# EAGLE design Driver (EAGLE 9.6.2)
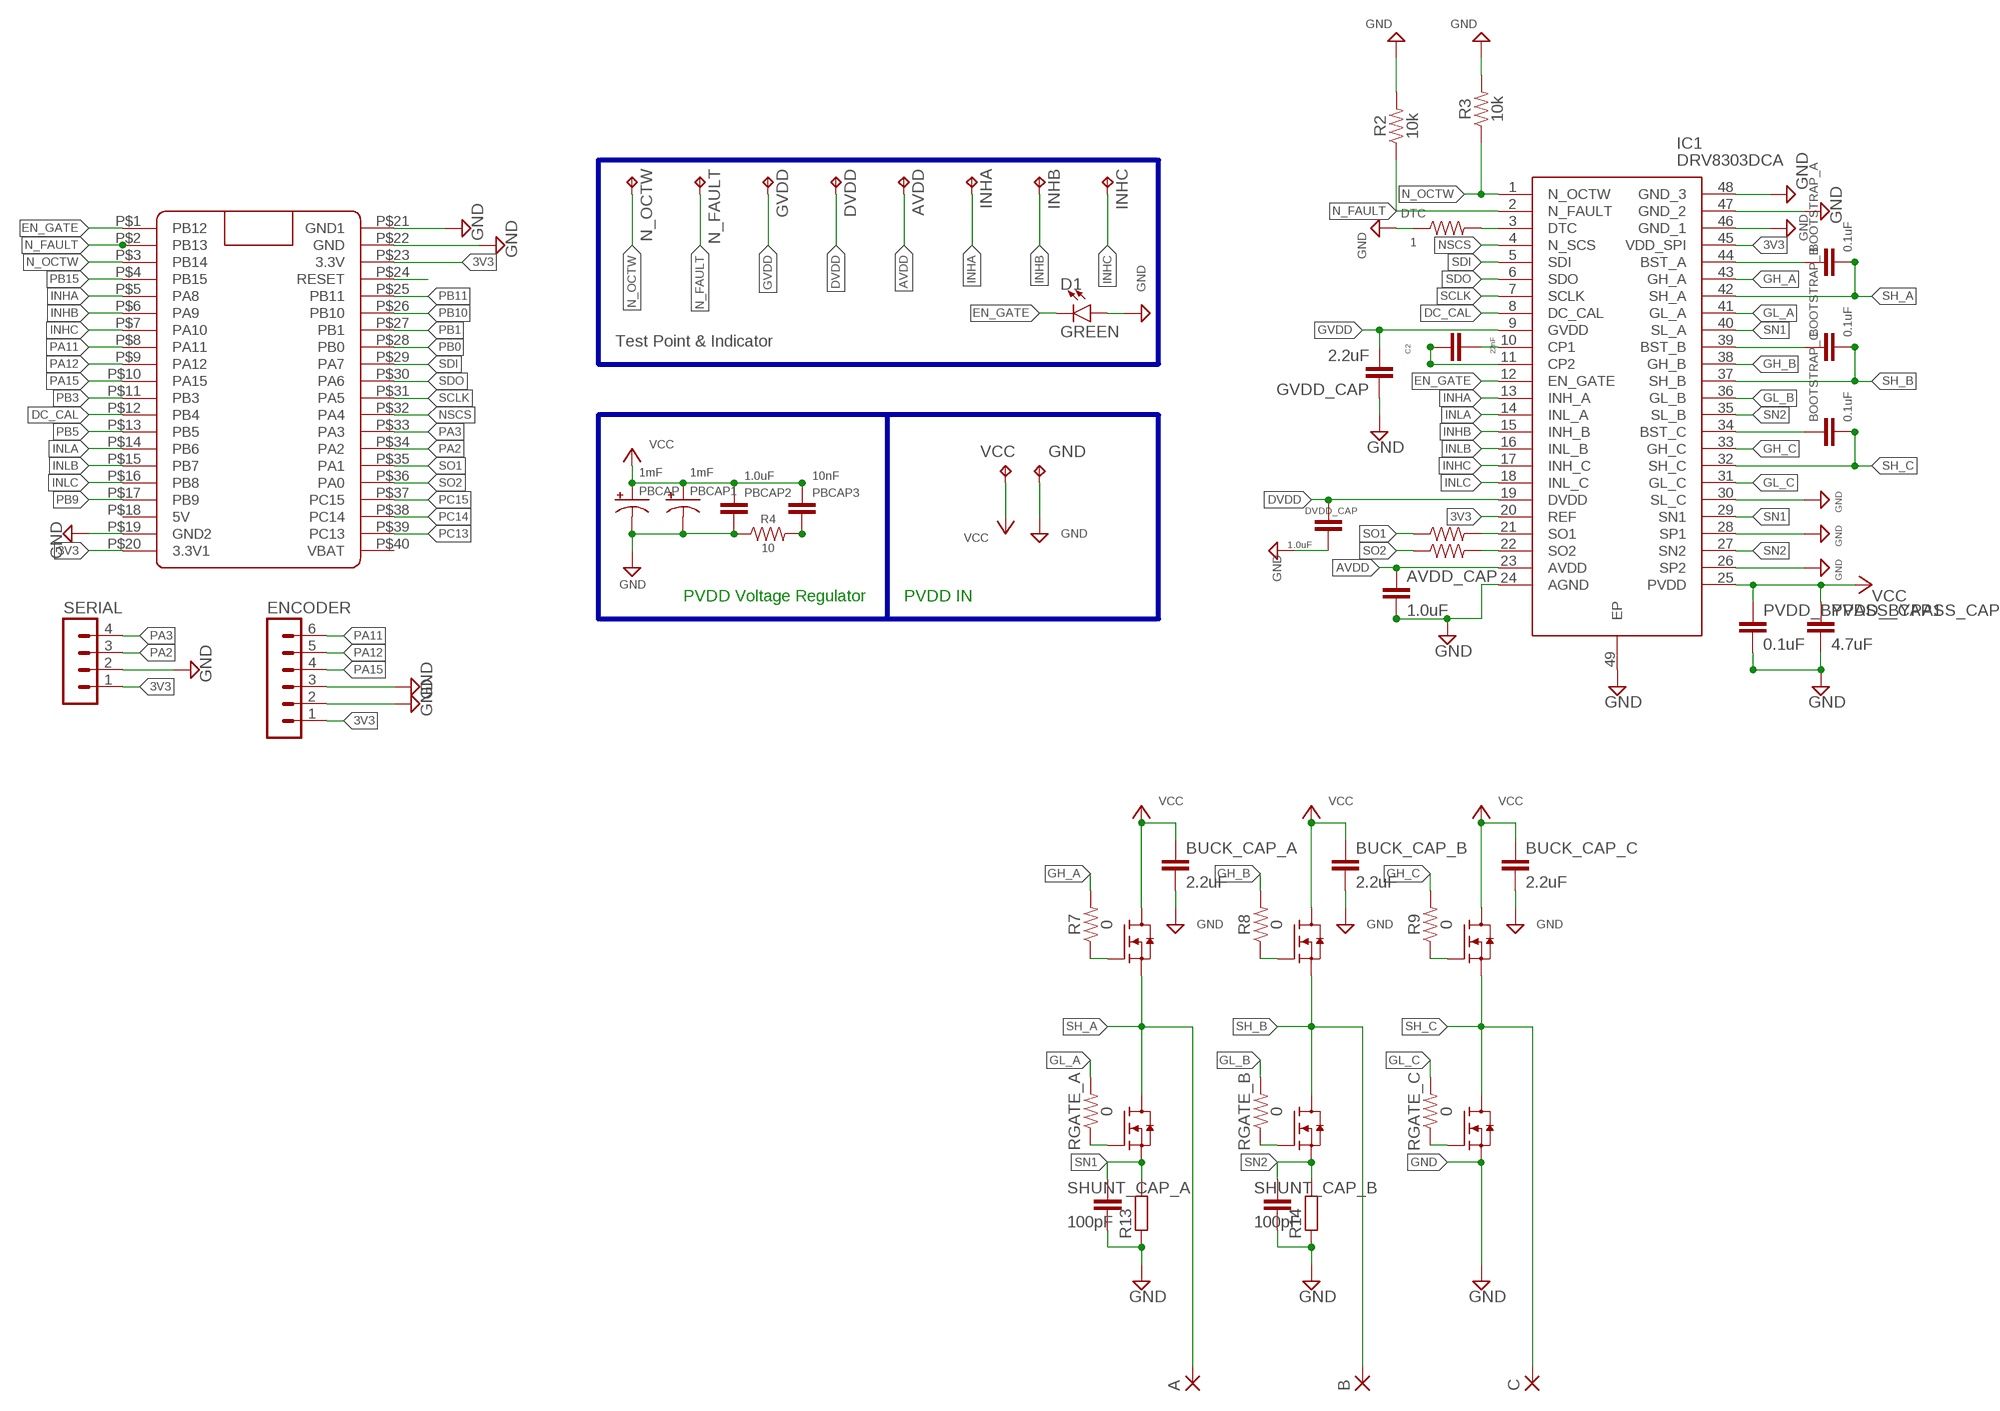
[diagram p0: schematic, sheet 1]

## Parts
A  SMD5  [SMD2,54-5,08]
AVDD  TPTP16R  [TP16R]
AVDD_CAP  1.0uF  1.0UF-0603-16V-10%  [0603]
B  SMD5  [SMD2,54-5,08]
BOOTSTRAP_A  0.1uF  0.1UF-0603-25V-(+80/-20%)  [0603]
BOOTSTRAP_B  0.1uF  0.1UF-0603-25V-(+80/-20%)  [0603]
BOOTSTRAP_C  0.1uF  0.1UF-0603-25V-(+80/-20%)  [0603]
BUCK_CAP_A  2.2uF  2.2UF-0603-10V-20%  [0603]
BUCK_CAP_B  2.2uF  2.2UF-0603-10V-20%  [0603]
BUCK_CAP_C  2.2uF  2.2UF-0603-10V-20%  [0603]
C  SMD5  [SMD2,54-5,08]
C2  22nF  22NF/22,000PF-0603-50V-10%  [0603]
D1  GREEN  LED-GREEN0603  [LED-0603]
DTC  1  1OHM-0603-1/10W-1%  [0603]
DVDD  TPTP16R  [TP16R]
DVDD_CAP  1.0uF  1.0UF-0603-16V-10%  [0603]
ENCODER  MA06-1  [MA06-1]
GND  TPPAD1-20Y  [P1-20Y]
GVDD  TPTP16R  [TP16R]
GVDD_CAP  2.2uF  2.2UF-0603-10V-20%  [0603]
HA  IRLR7843  [TO252]
HB  IRLR7843  [TO252]
HC  IRLR7843  [TO252]
IC1  DRV8303DCA  [SOP50P810X120-49N]
INHA  TPTP16R  [TP16R]
INHB  TPTP16R  [TP16R]
INHC  TPTP16R  [TP16R]
LA  IRLR7843  [TO252]
LB  IRLR7843  [TO252]
LC  IRLR7843  [TO252]
N_FAULT  TPTP16R  [TP16R]
N_OCTW  TPTP16R  [TP16R]
PBCAP  1mF  1000UF-RADIAL-5MM-25V-20%  [CPOL-RADIAL-5MM-10MM]
PBCAP1  1mF  1000UF-RADIAL-5MM-25V-20%  [CPOL-RADIAL-5MM-10MM]
PBCAP2  1.0uF  1.0UF-0603-16V-10%  [0603]
PBCAP3  10nF  10NF-0603-50V-10%  [0603]
PVDD_BYPASS_CAP1  0.1uF  0.1UF-0603-25V-(+80/-20%)  [0603]
PVDD_BYPASS_CAP2  4.7uF  4.7UF-0603-35V-(20%)  [0603]
R2  10k  10KOHM-0603-1/10W-1%  [0603]
R3  10k  10KOHM-0603-1/10W-1%  [0603]
R4  10  10OHM-0603-1/10W-1%  [0603]
R5  47  47OHM-0603-1/10W-1%  [0603]
R6  47  47OHM-0603-1/10W-1%  [0603]
R7  0  0OHM-0603-1/10W  [0603]
R8  0  0OHM-0603-1/10W  [0603]
R9  0  0OHM-0603-1/10W  [0603]
R13  R-EU_R2512  [R2512]
R14  R-EU_R2512  [R2512]
RGATE_A  0  0OHM-0603-1/10W  [0603]
RGATE_B  0  0OHM-0603-1/10W  [0603]
RGATE_C  0  0OHM-0603-1/10W  [0603]
SERIAL  MA04-1  [MA04-1]
SHUNT_CAP_A  100pF  100PF-0603-50V-5%  [0603]
SHUNT_CAP_B  100pF  100PF-0603-50V-5%  [0603]
U$1  BLUE_PILLADVANCED  [BLUE_PILL_ADV]
VCC  TPPAD1-20Y  [P1-20Y]

## Nets
3V3: ENCODER.1 IC1.20(REF) IC1.45(VDD_SPI) SERIAL.1 U$1.P$20(3.3V1) U$1.P$23(3.3V)
AVDD: AVDD.TP AVDD_CAP.1 IC1.23(AVDD)
DC_CAL: IC1.8(DC_CAL) U$1.P$12(PB4)
DVDD: DVDD.TP DVDD_CAP.1 IC1.19(DVDD)
EN_GATE: D1.C IC1.12(EN_GATE) U$1.P$1(PB12)
GH_A: IC1.43(GH_A) R7.2
GH_B: IC1.38(GH_B) R8.2
GH_C: IC1.33(GH_C) R9.2
GL_A: IC1.41(GL_A) RGATE_A.2
GL_B: IC1.36(GL_B) RGATE_B.2
GL_C: IC1.31(GL_C) RGATE_C.2
GND: AVDD_CAP.2 BUCK_CAP_A.2 BUCK_CAP_B.2 BUCK_CAP_C.2 D1.A DTC.1 DVDD_CAP.2 ENCODER.2 ENCODER.3 GND.TP GVDD_CAP.1 IC1.24(AGND) IC1.26(SP2) IC1.28(SP1) IC1.30(SL_C) IC1.46(GND_1) IC1.47(GND_2) IC1.48(GND_3) IC1.49(EP) LC.2(S) PBCAP1.- PBCAP2.2 PBCAP.- PVDD_BYPASS_CAP1.2 PVDD_BYPASS_CAP2.2 R2.2 R3.2 R4.1 R13.1 R14.1 SERIAL.2 SHUNT_CAP_A.2 SHUNT_CAP_B.2 U$1.P$19(GND2) U$1.P$21(GND1) U$1.P$22(GND)
GVDD: GVDD.TP GVDD_CAP.2 IC1.9(GVDD)
INHA: IC1.13(INH_A) INHA.TP U$1.P$5(PA8)
INHB: IC1.15(INH_B) INHB.TP U$1.P$6(PA9)
INHC: IC1.17(INH_C) INHC.TP U$1.P$7(PA10)
INLA: IC1.14(INL_A) U$1.P$14(PB6)
INLB: IC1.16(INL_B) U$1.P$15(PB7)
INLC: IC1.18(INL_C) U$1.P$16(PB8)
N$1: DTC.2 IC1.3(DTC)
N$3: PBCAP3.2 R4.2
N$4: U$1.P$24(RESET)
N$6: BOOTSTRAP_A.1 IC1.44(BST_A)
N$8: HA.1(G) R7.1
N$9: HB.1(G) R8.1
N$10: HC.1(G) R9.1
N$11: BOOTSTRAP_B.1 IC1.39(BST_B)
N$15: LC.1(G) RGATE_C.1
N$16: BOOTSTRAP_C.1 IC1.34(BST_C)
N$17: LB.1(G) RGATE_B.1
N$18: LA.1(G) RGATE_A.1
N$35: C2.2 IC1.10(CP1)
N$36: C2.1 IC1.11(CP2)
N_FAULT: IC1.2(N_FAULT) N_FAULT.TP R2.1 U$1.P$2(PB13)
N_OCTW: IC1.1(N_OCTW) N_OCTW.TP R3.1 U$1.P$3(PB14)
NSCS: IC1.4(N_SCS) U$1.P$32(PA4)
PA2: SERIAL.3 U$1.P$34(PA2)
PA3: SERIAL.4 U$1.P$33(PA3)
PA11: ENCODER.6 U$1.P$8(PA11)
PA12: ENCODER.5 U$1.P$9(PA12)
PA15: ENCODER.4 U$1.P$10(PA15)
PB0: U$1.P$28(PB0)
PB1: U$1.P$27(PB1)
PB3: U$1.P$11(PB3)
PB5: U$1.P$13(PB5)
PB9: U$1.P$17(PB9)
PB10: U$1.P$26(PB10)
PB11: U$1.P$25(PB11)
PB15: U$1.P$4(PB15)
PC13: U$1.P$39(PC13)
PC14: U$1.P$38(PC14)
PC15: U$1.P$37(PC15)
SCLK: IC1.7(SCLK) U$1.P$31(PA5)
SDI: IC1.5(SDI) U$1.P$29(PA7)
SDO: IC1.6(SDO) U$1.P$30(PA6)
SH_A: A.1(P) BOOTSTRAP_A.2 HA.2(S) IC1.42(SH_A) LA.3(D)
SH_B: B.1(P) BOOTSTRAP_B.2 HB.2(S) IC1.37(SH_B) LB.3(D)
SH_C: BOOTSTRAP_C.2 C.1(P) HC.2(S) IC1.32(SH_C) LC.3(D)
SN1: IC1.29(SN1) IC1.40(SL_A) LA.2(S) R13.2 SHUNT_CAP_A.1
SN2: IC1.27(SN2) IC1.35(SL_B) LB.2(S) R14.2 SHUNT_CAP_B.1
SO1: R5.1 U$1.P$35(PA1)
SO1B: IC1.21(SO1) R5.2
SO2: R6.1 U$1.P$36(PA0)
SO2B: IC1.22(SO2) R6.2
VCC: BUCK_CAP_A.1 BUCK_CAP_B.1 BUCK_CAP_C.1 HA.3(D) HB.3(D) HC.3(D) IC1.25(PVDD) PBCAP1.+ PBCAP2.1 PBCAP3.1 PBCAP.+ PVDD_BYPASS_CAP1.1 PVDD_BYPASS_CAP2.1 VCC.TP
Unconnected: U$1.P$18(5V) U$1.P$40(VBAT)

## Buses
B$1
B$2

## Notes on the sheet
- Test Point & Indicator
- PVDD Voltage Regulator | PVDD IN

## Library data of the parts
A B C = wirepad:SMD5: SMD PAD
AVDD DVDD GND GVDD INHA INHB INHC N_FAULT N_OCTW VCC = testpad:TP: Test pad
AVDD_CAP DVDD_CAP PBCAP2 = SparkFun-Capacitors:1.0UF: 1µF ceramic capacitors A capacitor is a passive two-terminal electrical component used to store electrical energy temporarily in an electric field.; PROD_ID: CAP-00868
BOOTSTRAP_A BOOTSTRAP_B BOOTSTRAP_C PVDD_BYPASS_CAP1 = SparkFun-Capacitors:0.1UF: 0.1µF ceramic capacitors A capacitor is a passive two-terminal electrical component used to store electrical energy temporarily in an electric field.; PROD_ID: CAP-00810
BUCK_CAP_A BUCK_CAP_B BUCK_CAP_C GVDD_CAP = SparkFun-Capacitors:2.2UF: 2.2µF ceramic capacitors A capacitor is a passive two-terminal electrical component used to store electrical energy temporarily in an electric field.; PROD_ID: CAP-07888
C2 = SparkFun-Capacitors:22NF/22,000PF: 0.022uF/22nF/22,000pF ceramic capacitors A capacitor is a passive two-terminal electrical component used to store electrical energy temporarily in an electric field.; PROD_ID: CAP-07885
D1 = SparkFun-LED:LED-GREEN: Green SMD LED Used in manufacturing of various products at SparkFun Packages: 0603 - SMD 0603 package [Product Link] <http://www.futureelectronics.com/en/technologies/semiconductors/optoelectronics/leds/Pages/9894312-LTST-C190GKT.aspx?CrossPart=HSMG-C190&IM=0> LilyPad 1206 - SMD1206 LilyPad package [Product Link] <http://www.futureelectronics.com/en/Technologies/Product.aspx?ProductID=IN150NGHARVATEKCORPORATION2049943&IM=0> 1206 - SMD1206 package [Product Link] <http://www.futureelectronics.com/en/technologies/semiconductors/optoelectronics/leds/Pages/8315665-LTST-C150KGKT.aspx?IM=0> 1206 Bottom Mount -SMD 1206 Bottom Mount [Product Link] <http://www.digikey.com/product-detail/en/lite-on-inc/LTST-C230KGKT/160-1456-1-ND/386854> SparkFun Products: Pro Mini 328 -5V <https://www.sparkfun.com/products/821> RedBoard <https://www.sparkfun.com/products/12757> MP3 Trigger <https://www.sparkfun.com/products/13720> Makey Makey <https://www.sparkfun.com/products/11076>; PROD_ID: DIO-00821
DTC = SparkFun-Resistors:1OHM: 1Ω resistor A resistor is a passive two-terminal electrical component that implements electrical resistance as a circuit element. Resistors act to reduce current flow, and, at the same time, act to lower voltage levels within circuits. - Wikipedia; PROD_ID: RES-08269
ENCODER = con-lstb:MA06-1: PIN HEADER; OC_FARNELL: unknown; OC_NEWARK: unknown
HA HB HC LA LB LC = BLDC project:IRLR7843
IC1 = DRV8303DCA:DRV8303DCA: Texas Instruments DRV8303DCA, Three-Phase Gate Driver With Dual-Current Shunt Source: Datasheet <https://componentsearchengine.com/Datasheets/2/DRV8303DCA.pdf>; ARROW_PART_NUMBER: DRV8303DCA; ARROW_PRICE-STOCK: https://www.arrow.com/en/products/drv8303dca/texas-instruments; DESCRIPTION: Texas Instruments DRV8303DCA, Three-Phase Gate Driver With Dual-Current Shunt; HEIGHT: 1.2mm; MANUFACTURER_NAME: Texas Instruments; MANUFACTURER_PART_NUMBER: DRV8303DCA; MOUSER_PART_NUMBER: 595-DRV8303DCA; MOUSER_PRICE-STOCK: https://www.mouser.co.uk/ProductDetail/Texas-Instruments/DRV8303DCA?qs=igp4D3uu33KLowzNFy6WPA%3D%3D
PBCAP PBCAP1 = SparkFun-Capacitors:1000UF: 1,000µF/1mF ceramic capacitors A capacitor is a passive two-terminal electrical component used to store electrical energy temporarily in an electric field. CAP-08070; PROD_ID: CAP-09538
PBCAP3 = SparkFun-Capacitors:10NF: 0.01uF/10nF/10,000pF ceramic capacitors A capacitor is a passive two-terminal electrical component used to store electrical energy temporarily in an electric field. CAP-09321; PROD_ID: CAP-00867
PVDD_BYPASS_CAP2 = SparkFun-Capacitors:4.7UF: 4.7µF ceramic capacitors A capacitor is a passive two-terminal electrical component used to store electrical energy temporarily in an electric field.; PROD_ID: CAP-14106
R2 R3 = SparkFun-Resistors:10KOHM: 10kΩ resistor A resistor is a passive two-terminal electrical component that implements electrical resistance as a circuit element. Resistors act to reduce current flow, and, at the same time, act to lower voltage levels within circuits. - Wikipedia; PROD_ID: RES-00824
R4 = SparkFun-Resistors:10OHM: 10Ω resistor A resistor is a passive two-terminal electrical component that implements electrical resistance as a circuit element. Resistors act to reduce current flow, and, at the same time, act to lower voltage levels within circuits. - Wikipedia; PROD_ID: RES-12581
R5 R6 = SparkFun-Resistors:47OHM: 47Ω resistor A resistor is a passive two-terminal electrical component that implements electrical resistance as a circuit element. Resistors act to reduce current flow, and, at the same time, act to lower voltage levels within circuits. - Wikipedia; PROD_ID: RES-14282
R7-R9 RGATE_A RGATE_B RGATE_C = SparkFun-Resistors:0OHM: 0Ω resistor A resistor is a passive two-terminal electrical component that implements electrical resistance as a circuit element. Resistors act to reduce current flow, and, at the same time, act to lower voltage levels within circuits. - Wikipedia; PROD_ID: RES-08609
R13 R14 = rcl:R-EU_: RESISTOR, European symbol; SPICEPREFIX: R
SERIAL = con-lstb:MA04-1: PIN HEADER; OC_FARNELL: unknown; OC_NEWARK: unknown
SHUNT_CAP_A SHUNT_CAP_B = SparkFun-Capacitors:100PF: 100pF/0.1nF ceramic capacitors A capacitor is a passive two-terminal electrical component used to store electrical energy temporarily in an electric field.; PROD_ID: CAP-07883
U$1 = BluePill:BLUE_PILL

## Board
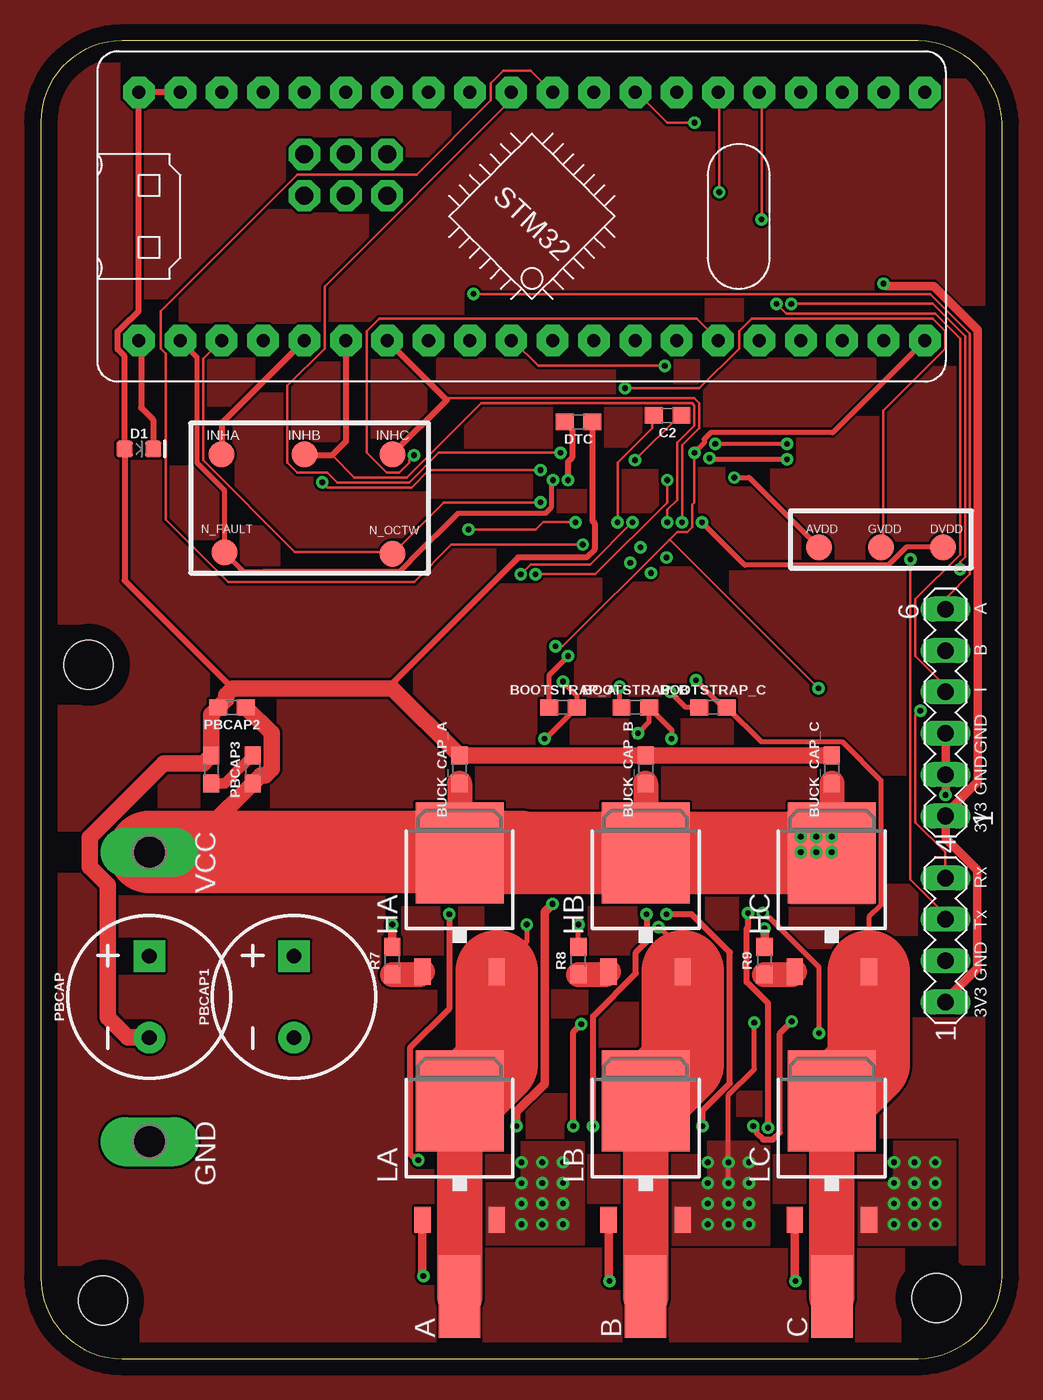
[diagram p1: board, top side]
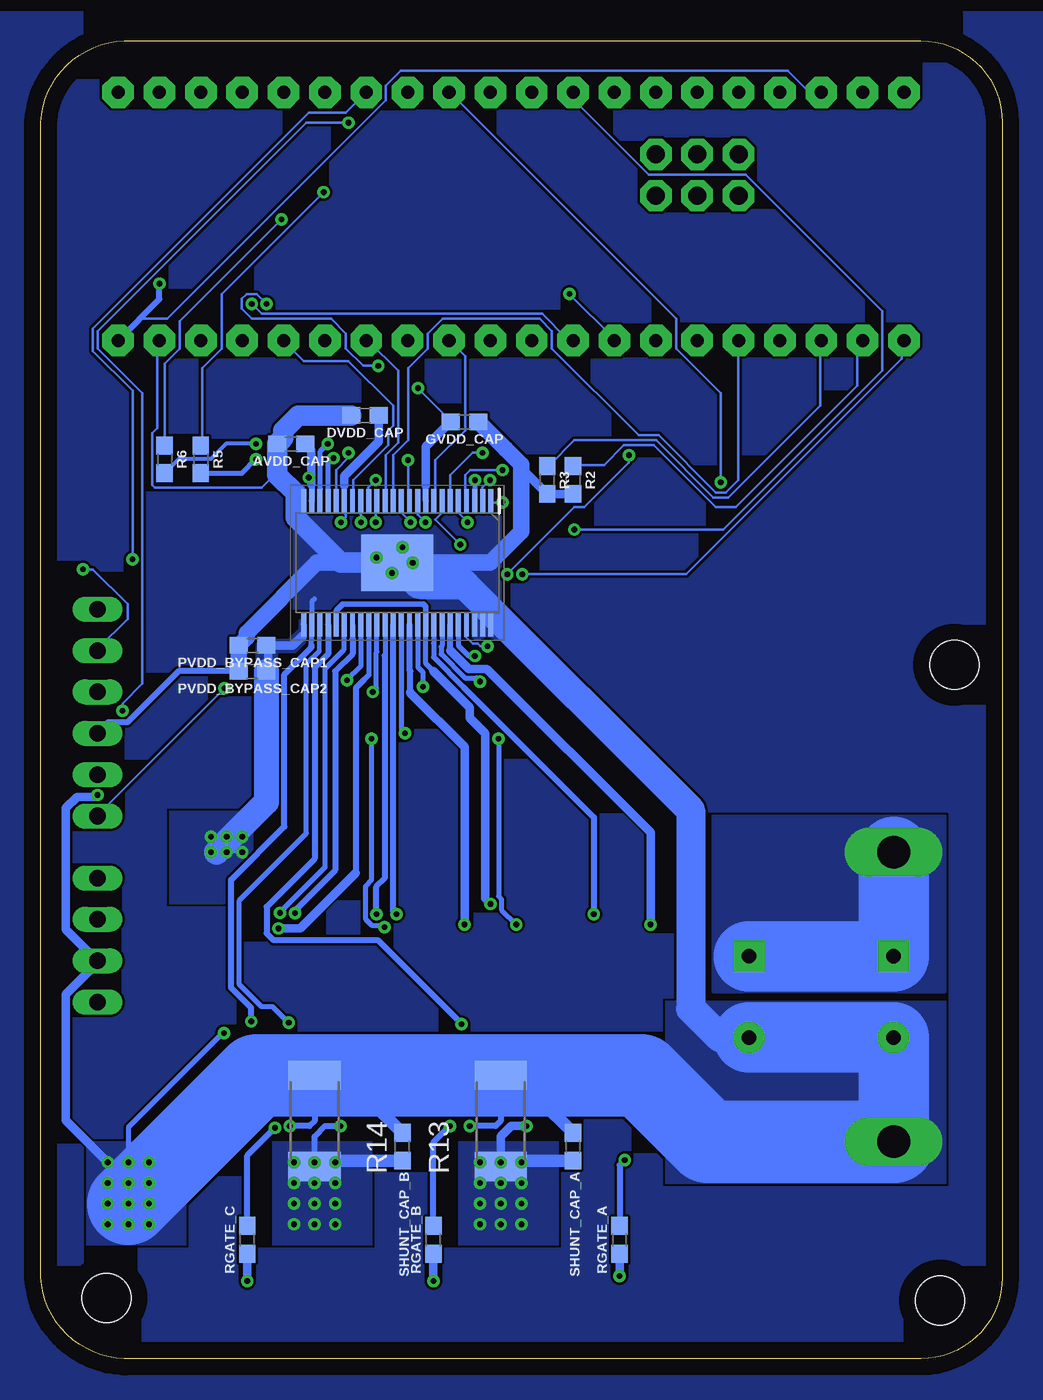
[diagram p2: board, bottom side, seen from below]

Size 59.04 x 80.97 mm. Coordinates in mm from the lower left corner, seen from the top.
Outline: 0,75.96 0,5.01 arc90 5,0.01 53.41,0.01 arc90 59.04,5.01 59.04,75.96 arc90 53.41,80.96 5,80.96 arc90 0,75.96
Copper layers (1*16): Top 0.035mm / dielectric 1.5mm / Bottom 0.035mm
Design rules "default *": minimum track width 6mil, minimum drill 0.35mm, track to track 6mil, track to pad 6mil, pad to pad 6mil, via to via 6mil, smd to smd 6mil, copper to edge 40mil, drill to drill 6mil, minimum pad ring 10mil, minimum via ring 8mil, stop-mask expansion 4mil, vias tented up to drill 3mm, thermal gap 10mil
Holes 3 mm at 3.81,3.58 55.01,3.74 2.94,42.63

### Footprints (pad centres in the part's own frame; a part is rotated, then mirrored left to right if it is on the bottom)
SMD2,54-5,08 = smd 2.54 x 5.08: 1 0,0
TP16R = smd 1.6 x 1.6: TP 0,0
0603 = smd 1.1 x 1: 1 -0.85,0; 2 0.85,0
LED-0603 = smd 1 x 1: A -0.877,0; C 0.877,0
MA06-1 = drill 1.016 long: 1 -6.35,0; 2 -3.81,0; 3 -1.27,0; 4 1.27,0; 5 3.81,0; 6 6.35,0
P1-20Y = drill 2.007 pad 2.54 long: TP 0,0
TO252 = smd 1 x 1.6: 1 -2.28,-4.8; 2 2.28,-4.8 | smd 5.4 x 6.2: 3 0,2.5
SOP50P810X120-49N = smd 1.475 x 0.3: 1 -3.788,5.75; 2 -3.788,5.25; 3 -3.788,4.75; 4 -3.788,4.25; 5 -3.788,3.75; 6 -3.788,3.25; 7 -3.788,2.75; 8 -3.788,2.25; 9 -3.788,1.75; 10 -3.788,1.25; 11 -3.788,0.75; 12 -3.788,0.25; 13 -3.788,-0.25; 14 -3.788,-0.75; 15 -3.788,-1.25; 16 -3.788,-1.75; 17 -3.788,-2.25; 18 -3.788,-2.75; 19 -3.788,-3.25; 20 -3.788,-3.75; 21 -3.788,-4.25; 22 -3.788,-4.75; 23 -3.788,-5.25; 24 -3.788,-5.75; 25 3.788,-5.75; 26 3.788,-5.25; 27 3.788,-4.75; 28 3.788,-4.25; 29 3.788,-3.75; 30 3.788,-3.25; 31 3.788,-2.75; 32 3.788,-2.25; 33 3.788,-1.75; 34 3.788,-1.25; 35 3.788,-0.75; 36 3.788,-0.25; 37 3.788,0.25; 38 3.788,0.75; 39 3.788,1.25; 40 3.788,1.75; 41 3.788,2.25; 42 3.788,2.75; 43 3.788,3.25; 44 3.788,3.75; 45 3.788,4.25; 46 3.788,4.75; 47 3.788,5.25; 48 3.788,5.75 | smd 3.48 x 4.42: 49 0,0
CPOL-RADIAL-5MM-10MM = drill 0.9 pad 1.93 square: + 2.5,0 | drill 0.9 pad 1.93: - -2.5,0
R2512 = smd 1.8 x 3.2: 1 -2.8,0; 2 2.8,0
MA04-1 = drill 1.016 long: 1 -3.81,0; 2 -1.27,0; 3 1.27,0; 4 3.81,0
BLUE_PILL_ADV = drill 0.8 pad 1.93 octagon: P$1 10.16,-30.48; P$2 10.16,-27.94; P$3 10.16,-25.4; P$4 10.16,-22.86; P$5 10.16,-20.32; P$6 10.16,-17.78; P$7 10.16,-15.24; P$8 10.16,-12.7; P$9 10.16,-10.16; P$10 10.16,-7.62; P$11 10.16,-5.08; P$12 10.16,-2.54; P$13 10.16,0; P$14 10.16,2.54; P$15 10.16,5.08; P$16 10.16,7.62; P$17 10.16,10.16; P$18 10.16,12.7; P$19 10.16,15.24; P$20 10.16,17.78; P$21 -5.08,-30.48; P$22 -5.08,-27.94; P$23 -5.08,-25.4; P$24 -5.08,-22.86; P$25 -5.08,-20.32; P$26 -5.08,-17.78; P$27 -5.08,-15.24; P$28 -5.08,-12.7; P$29 -5.08,-10.16; P$30 -5.08,-7.62; P$31 -5.08,-5.08; P$32 -5.08,-2.54; P$33 -5.08,0; P$34 -5.08,2.54; P$35 -5.08,5.08; P$36 -5.08,7.62; P$37 -5.08,10.16; P$38 -5.08,12.7; P$39 -5.08,15.24; P$40 -5.08,17.78 | drill 1.1 pad 1.93 octagon: P$42 -1.27,-20.32; P$43 -1.27,-17.78; P$44 -1.27,-15.24; P$45 1.27,-15.24; P$46 1.27,-17.78; P$47 1.27,-20.32

### Placement (x,y rotation side)
A  25.72,3.82 0 top
AVDD  47.78,49.85 0 top
AVDD_CAP  43.66,56.2 180 bottom
B  37.15,3.82 0 top
BOOTSTRAP_A  32.07,40.01 0 top
BOOTSTRAP_B  36.51,40.01 0 top
BOOTSTRAP_C  41.27,40.01 0 top
BUCK_CAP_A  25.72,36.2 90 top
BUCK_CAP_B  37.15,36.2 90 top
BUCK_CAP_C  48.58,36.2 90 top
C  48.58,3.82 0 top
C2  38.5,57.95 180 top
D1  6.03,55.89 0 top
DTC  33.02,57.55 180 top
DVDD  55.4,49.85 0 top
DVDD_CAP  39.13,57.95 180 bottom
ENCODER  55.56,39.69 90 top
GND  6.67,13.34 270 top
GVDD  51.59,49.85 0 top
GVDD_CAP  33.02,57.55 180 bottom
HA  25.72,28.58 0 top
HB  37.15,28.58 0 top
HC  48.58,28.58 0 top
IC1  37.15,48.9 270 bottom
INHA  11.11,55.57 0 top
INHB  16.19,55.57 0 top
INHC  21.59,55.57 0 top
LA  25.72,13.34 0 top
LB  37.15,13.34 0 top
LC  48.58,13.34 0 top
N_FAULT  11.27,49.54 0 top
N_OCTW  21.59,49.46 0 top
PBCAP  6.67,22.23 90 top
PBCAP1  15.56,22.23 90 top
PBCAP2  11.75,40.01 180 top
PBCAP3  13.02,36.2 90 top
PVDD_BYPASS_CAP1  46.04,43.82 180 bottom
PVDD_BYPASS_CAP2  46.04,42.23 180 bottom
R2  26.35,53.98 270 bottom
R3  27.94,53.98 270 bottom
R4  10.48,36.2 270 top
R5  49.21,55.25 270 bottom
R6  51.43,55.25 270 bottom
R7  21.59,24.45 90 top
R8  33.02,24.45 90 top
R9  44.45,24.45 90 top
R13  30.8,14.61 270 bottom
R14  42.23,14.61 270 bottom
RGATE_A  23.49,7.31 90 bottom
RGATE_B  34.92,7.31 90 bottom
RGATE_C  46.35,7.31 90 bottom
SERIAL  55.56,25.72 90 top
SHUNT_CAP_A  26.35,13.02 90 bottom
SHUNT_CAP_B  36.83,13.02 90 bottom
U$1  36.51,72.71 270 top
VCC  6.67,31.12 270 top

### Tracks (layer width: path | path; a pad name or v marks a point on that pad's centre or on a via)
3V3  (via drill 0.35)
  Top 0.152: v31.61,43.77 32.07,43.77 38.6,50.3 | 38.62,50.32 39.08,50.78 39.69,50.78 39.99,51.09 39.99,52.46 40.14,52.61 v40.14,55.66 | 38.62,50.32 38.6,50.3 | 38.62,50.32 v47.76,41.18 | 38.6,50.3
  Top 0.305: U$1.P$20 48.63,56.89 41.14,56.89 40.74,56.49 40.74,56.25 v40.14,55.66
  Top 0.508: SERIAL.1 55.56,22.04 57.49,23.97 57.49,30.02 55.56,31.95 ENCODER.1 55.56,33.47 57.54,35.45 57.54,63.17 54.82,65.89 51.9,65.89 v51.75,66.05
  Bottom 0.152: v31.61,43.77 32.07,43.77 32.22,43.92 32.52,43.92 32.98,44.38 32.98,44.99 IC1.45 | v40.14,55.66 40.14,55.35 40.91,54.59 40.91,52.76 IC1.20 | U$1.P$23 11.19,77.91 11.95,77.91 13.17,79.13 36.94,79.13 37.86,78.21 37.86,77.3 51.27,63.89 52.95,63.89 54.17,62.67 U$1.P$20 | v47.76,41.18 55.54,33.41 ENCODER.1
  Bottom 0.381: U$1.P$20 51.75,65.09 v51.75,66.05
AVDD  (via drill 0.35)
  Top 0.305: v42.58,54.13 43.5,54.13 AVDD.TP
  Bottom 0.152: v42.58,54.13 42.43,54.13
  Bottom 0.381: 42.43,53.69 42.43,53.6 42.4,53.57 IC1.23
  Bottom 0.508: AVDD_CAP.1 42.43,55.83 42.43,54.13 42.43,53.69
DC_CAL
  Bottom 0.152: IC1.8 34.81,52.76 34.81,55.2 32.98,57.03 32.98,61.6 33.9,62.52 U$1.P$12
DVDD  (via drill 0.35)
  Top 0.305: DVDD.TP 53.16,49.85 52.05,48.75 43.24,48.75 v40.6,51.39
  Bottom 0.152: v40.6,51.39 40.3,51.7 40.3,51.85 40.45,52 40.45,52.61 IC1.19
  Bottom 0.305: 40.4,53.65 IC1.19
  Bottom 0.508: DVDD_CAP.1 38.28,56.34 40.39,54.23 40.39,53.66 40.4,53.65
EN_GATE  (via drill 0.35)
  Top 0.152: v36.33,51.39 33.74,48.8 30.09,48.8 v29.48,48.19
  Top 0.381: U$1.P$1 6.16,62.43 6.16,58.43 6.91,57.68 D1.C
  Bottom 0.152: v36.33,51.39 36.94,52 36.94,52.61 IC1.12 | v29.48,48.19 19.42,48.19 6.16,61.45 6.16,62.52 U$1.P$1
GH_A  (via drill 0.35)
  Top 0.508: R7.2 v21.59,26.68
  Bottom 0.381: 33.9,43.52 IC1.43
  Bottom 0.508: 33.9,43.52 32.76,42.38 31.65,42.38 21.59,32.33 v21.59,26.68
GH_B  (via drill 0.35)
  Top 0.305: R8.2 v33.02,26.68
  Bottom 0.381: 36.34,40.95 36.34,42.25 36.39,42.3 IC1.38
  Bottom 0.508: v33.02,26.68 33.02,37.59 36.34,40.91 36.34,40.95
GH_C  (via drill 0.35)
  Top 0.508: R9.2 v44.45,26.44
  Bottom 0.305: IC1.33 38.9,42 39.18,41.72
  Bottom 0.381: 39.18,41.72 39.69,41.21 39.69,29.85
  Bottom 0.508: v44.45,26.44 43.1,26.44 39.69,29.85
GL_A  (via drill 0.35)
  Top 0.381: v25.08,27.31 25.08,21.49 22.67,19.08 22.67,12.6 22.88,12.4 22.99,12.4 v23.18,12.21
  Bottom 0.305: IC1.41 34.9,43.95 34.91,43.94 34.91,43.1 33.07,41.25
  Bottom 0.381: 33.07,41.25 25.08,33.26 v25.08,27.31 | v23.18,12.21 23.49,11.89 RGATE_A.2
GL_B  (via drill 0.35)
  Top 0.381: v37.2,27.31 37.2,25.63 36.54,24.98 36.54,23.67 33.92,21.05 v33.92,14.29
  Bottom 0.381: RGATE_B.2 34.92,13.29 v33.92,14.29 | v37.2,27.31 37.4,27.51 IC1.36
GL_C  (via drill 0.35)
  Top 0.381: v44.66,14.19 44.66,21.83 43.35,23.15 43.35,26.43 43.43,26.52 v43.43,27.38
  Bottom 0.305: IC1.31 39.9,44.23
  Bottom 0.381: RGATE_C.2 46.35,12.49 v44.66,14.19 | v43.43,27.38 43.27,27.53 43.27,27.69 40.96,30.01 40.96,42.23 39.9,43.29 39.9,44.23
GND  (via drill 0.35)
  Top 0.152: 6.01,64.34 6.01,64.46
  Top 0.305: v44.34,27.39 44.61,27.12 44.73,27.12 47.78,24.07 v47.78,20.01
  Top 0.381: 21.27,41.18 29.31,49.22 33.51,49.22 34.01,49.72 34.01,51.33 33.87,51.46 DTC.1 | U$1.P$22 U$1.P$21 6.01,77.77 6.01,64.46 | 6.01,64.34 5.52,63.86 5.49,63.86 4.72,63.1 4.72,62.01 5.16,61.58 D1.A 5.16,47.81 11.78,41.18 | v32.7,14.29 32.7,20.07 v33.2,20.56 | v46.12,20.72 45.38,19.99 45.38,13.89 44.96,13.47 44.36,13.47 43.94,13.89 43.94,14.11 v43.75,14.29
  Top 0.508: ENCODER.3 ENCODER.2 v55.56,34.64
  Top 1.016: PBCAP.- 5.36,19.73 4.13,20.96 4.13,29.09 3,30.22 3,32.02 7.54,36.56 9.99,36.56 R4.1 10.48,39.59 PBCAP2.2 11.39,40.5 11.39,40.79 11.78,41.18 21.27,41.18 21.59,41.18 BUCK_CAP_A.2 BUCK_CAP_B.2 BUCK_CAP_C.2
  Bottom 0.152: U$1.P$19 51.88,62.52 51.88,57.18 52.18,56.88 52.18,53.68 52.03,53.52 45.48,53.52 45.02,53.98 44.51,54.29
  Bottom 0.305: 42.23,46.68 42.4,46.51 IC1.26 42.4,44.66 42.4,44.65 42.4,44.13 42.43,44.1 42.43,43.82 | IC1.30 40.44,45.07 40.44,43.54 41.59,42.39 41.59,30.18 44.11,27.66 44.11,27.62 v44.34,27.39 | v47.78,20.01 47.86,20.01 53.66,14.21 v53.66,12.07
  Bottom 0.381: R13.1 30.8,15.88 30.8,14.61 31.11,14.29 v32.7,14.29 | R14.1 42.23,17.15 42.23,14.61 42.55,14.29 v43.75,14.29 | ENCODER.3 54.9,39.09 53.71,39.09 50.57,42.23 PVDD_BYPASS_CAP2.2 | IC1.28 41.4,43.29 42.22,42.47 42.22,30.72 45.17,27.77 45.17,26.14 44.75,25.72 38.35,25.72 v33.2,20.56 | v46.12,20.72 46.12,21.56 47.35,22.79 47.35,29.43 44.08,32.69 44.08,42.05 42.43,43.7 42.43,43.82
  Bottom 0.508: 30.49,55.87 30.49,55.68 R3.2 R2.2 | v53.66,10.8 57.49,14.64 57.49,22.4 55.56,24.33 SERIAL.2 57.49,26.38 57.49,33.83 56.81,34.51 55.69,34.51 v55.56,34.64
  Bottom 0.762: SHUNT_CAP_A.2 28.36,15.88 30.8,15.88 | SHUNT_CAP_B.2 40.11,17.15 42.23,17.15
  Bottom 1.016: PVDD_BYPASS_CAP2.2 PVDD_BYPASS_CAP1.2 46.4,44.31 46.4,44.6 42.09,48.9 IC1.49 31.43,48.9 29.53,50.81 29.53,54.93 29.55,54.93 30.49,55.87 GVDD_CAP.1
  Bottom 1.27: DVDD_CAP.2 43.22,57.95 44.14,57.03 44.14,56.57 AVDD_CAP.2 44.51,54.29 43.38,53.16 43.38,51.67 40.61,48.9 IC1.49
  Bottom 1.778: IC1.49 35.81,47.57 32.99,47.57 19.13,33.71 19.13,21.52 17.34,19.73 PBCAP1.-
  Bottom 4.318: GND.TP PBCAP.- PBCAP1.-
  Bottom 5.08: GND.TP 18.1,13.34 22.17,17.41 R13.1 R14.1 45.78,17.41 v53.66,9.53
  other vias: 52.39,12.07 52.39,10.8 54.93,10.8 54.93,12.07 52.39,9.53 54.93,9.53 52.39,8.26 53.66,8.26 54.93,8.26 36.83,49.85 36.2,48.9 37.46,48.27 38.42,49.22
  pour Top (no thermals): 50.16,10.8 50.16,6.99 56.2,6.99 56.2,13.34 52.39,13.34 52.39,10.8
  pour Bottom (no thermals): 50.16,13.34 50.16,6.99 56.2,6.99 56.2,13.34
  pour Bottom (no thermals): 30.8,51.76 30.8,46.04 43.5,46.04 43.5,51.76
  pour Bottom (no thermals): 30.8,46.04 30.8,44.14 32.7,44.14 32.7,46.04
  pour Bottom (no thermals): 43.5,51.76 43.5,53.66 42.55,53.66 42.55,51.76
  pour Bottom (no thermals): 3.49,10.8 3.49,21.91 20.64,21.91 20.64,10.8
GVDD  (via drill 0.35)
  Top 0.152: v35.88,59.62 40.45,59.62 42.89,62.06 42.89,63.13 43.65,63.89 54.78,63.89 55.54,63.13 55.54,62.06 51.73,58.25 51.73,49.87 GVDD.TP
  Bottom 0.152: v35.88,59.62 34.05,57.79 GVDD_CAP.2
  Bottom 0.381: IC1.9 35.4,53.65
  Bottom 0.508: GVDD_CAP.2 35.4,56.03 35.4,53.65
INHA
  Top 0.381: U$1.P$5 11.11,57.47 INHA.TP
  Bottom 0.152: IC1.13 37.4,52.76 37.4,55.51 36.49,56.42 36.49,60.84 35.27,62.06 35.27,62.97 34.35,63.89 28.41,63.89 27.65,63.13 27.65,62.06 22.31,56.72 21.09,56.72 17.59,53.22 16.98,53.22 16.22,53.98 16.22,62.52 U$1.P$5
INHB  (via drill 0.35)
  Top 0.152: v38.47,51.39 38.47,52.15 39.08,52.76 39.08,56.27 40.14,57.33 40.14,58.55 39.99,58.71 27.04,58.71 22.47,54.13 19.27,54.13 17.89,55.51 | 16.22,55.51 INHB.TP
  Top 0.381: U$1.P$6 18.73,56.34 17.89,55.51 16.22,55.51
  Bottom 0.152: v38.47,51.39 38.47,52.61 IC1.15
INHC  (via drill 0.35)
  Top 0.152: v39.38,51.39 39.38,56.12 40.45,57.18 40.45,58.71 40.14,59.01 25.06,59.01 | 25.06,59.01 24.94,58.89 21.7,55.66 INHC.TP | 24.81,59.11 24.9,59.01 25.06,59.01 | 24.81,59.11 21.4,62.52 U$1.P$7 | 24.81,59.11
  Top 0.381: U$1.P$7 24.92,58.9 | 24.94,58.89 24.92,58.9 | 24.92,58.9 INHC.TP
  Bottom 0.152: v39.38,51.39 39.38,51.54 39.23,51.7 39.38,51.85 39.38,52.61 IC1.17
INLA
  Bottom 0.152: IC1.14 37.86,52.76 37.86,55.51 37.1,56.27 37.1,60.69 38.93,62.52 U$1.P$14
INLB  (via drill 0.35)
  Top 0.152: v38.47,53.98 38.47,52.61 34.05,48.19 v30.39,48.19 | v22.92,55.51 22.62,55.2 22.62,55.05 22.01,54.44 21.25,54.44 20.03,55.66 20.03,63.13 20.79,63.89 40.3,63.89 41.52,62.67 U$1.P$15
  Bottom 0.152: v38.47,53.98 38.93,53.52 38.93,52.76 IC1.16 | v30.39,48.19 26.28,52.31 25.67,52.31 22.92,55.05 v22.92,55.51
INLC
  Bottom 0.152: IC1.18 39.84,52.76 39.84,53.98 37.71,56.12 37.71,57.03 37.4,57.33 37.4,58.55 40.14,61.3 42.89,61.3 44.11,62.52 U$1.P$16
N$1  (via drill 0.35)
  Top 0.381: v32.37,53.98 32.37,55.1 32.64,55.36 32.64,57.09 DTC.2
  Bottom 0.152: 32.37,53.03 32.37,52.76 IC1.3
  Bottom 0.305: v32.37,53.98 32.4,53.96 IC1.3
N$2
  pour Bottom (rank 2): -7.3,81.92 -7.3,-4.44 72.71,-4.44 72.71,81.92
N$3
  Top 0.635: PBCAP3.2 12.34,36.37 12.32,36.37 11.3,35.35 R4.2
N$5
  pour Top (rank 2): -7.3,83.19 -7.3,-4.44 72.71,-4.44 72.71,83.19
N$6  (via drill 0.35)
  Top 0.305: BOOTSTRAP_A.1 31.22,42 v32.38,43.17
  Bottom 0.305: IC1.44 33.4,43.81 32.76,43.17 v32.38,43.17
N$8
  Top 1.524: R7.1 23.26,23.6 HA.1
N$9
  Top 1.524: R8.1 34.69,23.6 HB.1
N$10
  Top 1.524: R9.1 46.12,23.6 HC.1
N$11  (via drill 0.35)
  Top 0.305: BOOTSTRAP_B.1 35.56,40.11 v35.56,41.28
  Bottom 0.305: v35.56,41.28 35.56,42.17 35.87,42.48 35.87,45.08 IC1.39
N$15  (via drill 0.35)
  Top 0.508: v46.35,4.77 46.3,4.83 LC.1
  Bottom 0.508: RGATE_C.1 v46.35,4.77
N$16  (via drill 0.35)
  Top 0.305: BOOTSTRAP_C.1 39.6,40.01 v38.65,40.96
  Bottom 0.305: v38.65,40.96 38.43,41.19 38.43,43.39 38.4,43.42 IC1.34
N$17  (via drill 0.35)
  Top 0.508: v34.92,4.77 34.87,4.83 LB.1
  Bottom 0.508: RGATE_B.1 v34.92,4.77
N$18  (via drill 0.35)
  Top 0.508: v23.49,5.09 23.44,5.14 LA.1
  Bottom 0.508: RGATE_A.1 v23.49,5.09
N$35  (via drill 0.35)
  Top 0.152: v35.42,51.39 35.42,55.05 37.55,57.18 37.55,57.94 C2.2
  Bottom 0.152: v35.42,51.39 35.88,51.85 35.88,52.61 IC1.10
N$36  (via drill 0.35)
  Top 0.152: v36.49,55.2 39.23,57.94 C2.1
  Bottom 0.152: v36.49,55.2 36.49,52.76 IC1.11
N_FAULT  (via drill 0.35)
  Top 0.305: U$1.P$2 9.59,61.54 9.59,55.04 11.27,53.36 N_FAULT.TP 12.47,48.34 13.65,48.34 13.66,48.35 22.05,48.35 22.69,49 22.69,49.03 25.59,51.93 30.98,51.93 31.38,52.33 31.38,53.9 v31.46,53.98
  Bottom 0.152: v31.46,53.98 31.92,53.52 31.92,52.76 IC1.2 | R2.1 26.28,54.9 24.45,54.9 23.23,56.12 21.4,56.12 17.59,52.31 16.37,52.31 8.9,59.77 8.9,62.52 U$1.P$2
  Bottom 0.254: 8.79,62.55 U$1.P$2
N_OCTW  (via drill 0.35)
  Top 0.152: v30.7,52.61 24.75,52.61 21.7,49.56 N_OCTW.TP 21.55,49.56 15.61,49.56 9.97,55.2 9.97,61.45 11.04,62.52 U$1.P$3
  Bottom 0.152: v30.7,52.61 31.31,52.61 IC1.1 | R3.1 27.8,54.9 26.28,56.42 21.25,56.42 17.74,52.91 16.83,52.91 11.19,58.55 11.19,62.52 U$1.P$3
NSCS  (via drill 0.35)
  Top 0.152: v30.7,54.59 23.84,54.59 22.77,53.52 17.59,53.52 v17.28,53.83
  Bottom 0.152: v30.7,54.59 32.68,54.59 32.98,54.29 32.98,52.76 IC1.4 | v17.28,53.83 17.28,59.32 20.03,62.06 20.03,63.89 33.9,77.76 U$1.P$32
PA2  (via drill 0.35)
  Top 0.152: v53.4,49.1 53.4,29.45 55.54,27.31 55.54,27.01 SERIAL.3
  Bottom 0.152: v53.4,49.1 53.4,59.47 55.84,61.91 55.84,63.28 42.58,76.54 40.3,76.54 39.08,77.76 U$1.P$34
PA3  (via drill 0.35)
  Top 0.152: v54.01,39.81 53.71,39.5 53.71,32.95 55.54,31.12 55.54,29.6 SERIAL.4 | v40.14,75.93 38.47,75.93 36.64,77.76 U$1.P$33
  Bottom 0.152: v54.01,39.81 54.01,40.27 52.79,41.48 52.79,59.32 55.54,62.06 55.54,63.13 42.74,75.93 v40.14,75.93
PA11  (via drill 0.35)
  Top 0.152: v26.58,65.41 54.62,65.41 57.06,62.97 57.06,48.19 55.69,46.82 55.69,46.06 ENCODER.6
  Bottom 0.152: v26.58,65.41 23.84,62.67 U$1.P$8
PA12  (via drill 0.35)
  Top 0.152: v56.45,48.5 56.45,48.95 56.76,49.26 56.76,62.82 54.78,64.8 v46.09,64.8
  Bottom 0.152: v56.45,48.5 55.84,48.5 53.71,46.36 53.71,45.45 55.54,43.62 ENCODER.5 | v46.09,64.8 45.48,64.19 28.26,64.19 26.73,62.67 U$1.P$9
  Bottom 0.254: U$1.P$9 26.67,62.55
PA15  (via drill 0.35)
  Top 0.152: v45.17,64.8 45.78,64.19 54.93,64.19 56.45,62.67 56.45,49.41 53.71,46.67 53.71,43.16 55.54,41.33 55.54,41.03 ENCODER.4 | v38.32,60.99 30.54,60.99 29.02,62.52 U$1.P$10
  Bottom 0.152: v45.17,64.8 45.78,65.41 46.39,65.41 46.7,65.11 46.7,64.5 46.09,63.89 41.21,63.89 40.3,62.97 40.3,62.06 39.23,60.99 v38.32,60.99
SCLK  (via drill 0.35)
  Top 0.152: v33.29,50.02 25.22,50.02 22.92,47.72 11.51,47.72 7.68,51.54 7.68,61.75 7.38,62.06 7.38,64.34 15.76,72.73 23.08,72.73 27.65,77.3 27.65,78.37 28.41,79.13 30.09,79.13 31.31,77.91 U$1.P$31
  Bottom 0.152: v33.29,50.02 34.81,51.54 34.35,52 34.35,52.61 IC1.7
SDI  (via drill 0.35)
  Top 0.152: v32.83,51.39 30.85,51.39 30.39,50.93 v26.28,50.93
  Bottom 0.152: v32.83,51.39 33.44,52 33.44,52.61 IC1.5 | v26.28,50.93 17.13,50.93 7.38,60.69 7.38,64.34 15.76,72.73 21.7,72.73 26.28,77.3 26.28,77.76 U$1.P$29
SDO  (via drill 0.35)
  Top 0.152: v31.92,55.66 24.45,55.66 22.62,53.83 18.2,53.83 17.59,54.44 15.76,54.44 15.15,55.05 15.15,59.77 17.44,62.06 17.44,65.87 28.87,77.3 28.87,77.76 U$1.P$30
  Bottom 0.152: v31.92,55.66 32.52,55.66 33.9,54.29 33.9,52.76 IC1.6
SH_A  (via drill 0.35)
  Top 0.152: A.1 25.82,3.84 25.72,3.84
  Top 0.305: v32.07,41.6 32.92,40.75 BOOTSTRAP_A.2 31,38.09 v30.93,38.09 | v29.85,26.68 29.85,25.63 HA.2
  Top 2.794: LA.3 25.72,3.84 A.1
  Top 5.08: HA.2 28,18.12 LA.3
  Bottom 0.305: v32.07,41.6 32.29,41.82 32.99,41.82 34.46,43.28 34.46,43.75 34.4,43.81 IC1.42 | v30.93,38.09 30.93,28.41 30.75,28.23 30.75,27.58 v29.85,26.68
SH_B  (via drill 0.35)
  Top 0.305: v36.68,38.42 37.36,39.11 BOOTSTRAP_B.2 38.74,38.64 v38.74,38.09 | v37.94,26.52 39.43,25.03 HB.2
  Top 2.794: LB.3 B.1
  Top 5.08: HB.2 39.43,18.12 LB.3
  Bottom 0.305: IC1.37 36.9,38.65 v36.68,38.42 | v38.74,38.09 38.74,29.4 39.11,29.03 39.11,27.03 38.71,26.63 38.05,26.63 v37.94,26.52
SH_C  (via drill 0.35)
  Top 0.305: v40.24,41.68 41.91,40.01 BOOTSTRAP_C.2 44.23,37.91 49.2,37.91 51.58,35.53 51.58,27.86 50.86,27.13 HC.2
  Top 2.794: LC.3 C.1
  Top 5.08: HC.2 50.86,18.12 LC.3
  Bottom 0.305: IC1.32 39.4,42.52 v40.24,41.68
SN1  (via drill 0.35)
  Top 0.508: v29.21,14.29 29.21,15.17 30.94,16.9 30.94,27.46 v31.43,27.95
  Bottom 0.305: 40.87,45.98 40.9,45.95 IC1.29 | 34.92,42.23 35.4,42.71 35.4,44.14 | 35.4,44.14 IC1.40 | 35.4,44.14
  Bottom 0.33: IC1.40 35.4,46.2 35.56,46.36 40.49,46.36 40.87,45.98
  Bottom 0.508: R13.2 v30.8,12.07 30.8,13.66 30.16,14.29 v29.21,14.29 | v31.43,27.95 31.75,28.26 31.75,38.42 32.7,39.38 32.7,40.01 34.92,42.23
  Bottom 0.762: SHUNT_CAP_A.1 30.7,12.17 v30.8,12.07
  other vias: 29.53,12.07 32.07,12.07 29.53,10.8 30.8,10.8 32.07,10.8 29.53,9.53 30.8,9.53 32.07,9.53 29.53,8.26 30.8,8.26 32.07,8.26
  pour Top (no thermals): 29.53,13.34 33.34,13.34 33.34,6.99 27.3,6.99 27.3,10.8 29.53,10.8
  pour Bottom (no thermals): 27.3,13.34 27.3,6.99 33.34,6.99 33.34,13.34
SN2  (via drill 0.35)
  Top 0.305: v42.23,10.8 42.23,16.2 43.81,17.79 v43.81,20.64
  Top 0.381: v40.64,14.29 40.64,15.26 42.31,16.93 42.31,24.98 39.97,27.31 v38.43,27.31
  Bottom 0.254: IC1.27 41.94,45.07
  Bottom 0.279: 41.94,45.07 41.94,43.44
  Bottom 0.305: IC1.35 37.9,43.22 37.93,43.19 | 41.94,43.44 42.72,42.66 42.72,32.28 46.85,28.15 46.85,23 45.48,21.63 44.8,21.63 v43.81,20.64
  Bottom 0.381: R14.2 v42.23,12.07 42.23,13.66 41.59,14.29 v40.64,14.29 | v38.43,27.31 38.43,29.01 37.93,29.51 37.93,43.19
  Bottom 0.762: SHUNT_CAP_B.1 42.13,12.17 v42.23,12.07
  other vias: 40.96,12.07 43.5,12.07 40.96,10.8 43.5,10.8 40.96,9.53 42.23,9.53 43.5,9.53 40.96,8.26 42.23,8.26 43.5,8.26
  pour Top (no thermals): 38.73,10.8 38.73,6.99 44.77,6.99 44.77,13.34 40.96,13.34 40.96,10.8
  pour Bottom (no thermals): 38.73,13.34 38.73,6.99 44.77,6.99 44.77,13.34
SO1  (via drill 0.35)
  Top 0.152: v41.67,71.66 41.67,77.76 U$1.P$35
  Bottom 0.152: v41.67,71.66 47.92,65.41 47.92,62.06 49.14,60.84 49.14,56.12 R5.1
SO1B  (via drill 0.35)
  Top 0.305: v41.06,55.33 41.14,55.25 v45.83,55.25
  Bottom 0.305: IC1.21 41.4,55 v41.06,55.33 | R5.2 46.68,54.4 v45.83,55.25
SO2  (via drill 0.35)
  Top 0.152: v44.26,69.98 44.26,77.76 U$1.P$36
  Bottom 0.152: v44.26,69.98 50.51,63.74 50.51,62.06 51.42,61.14 51.42,56.12 R6.1
SO2B  (via drill 0.35)
  Top 0.254: v41.42,56.2 v45.83,56.2
  Bottom 0.254: v45.83,56.2 47.66,56.2 48.6,55.27 50.56,55.27 R6.2
  Bottom 0.305: IC1.22 41.9,53.43 41.87,53.45 41.87,55.75 v41.42,56.2
VCC  (via drill 0.35)
  Top 0.152: v47.63,32.07 47.63,32.03 HC.3 v48.58,31.12 v48.58,32.07
  Top 0.635: 10.27,32.6 8.79,31.12 VCC.TP
  Top 1.016: PBCAP2.1 14.18,38.43 14.18,36.23 13.79,35.84 13.51,35.84 PBCAP3.1 10.27,32.6
  Top 1.524: BUCK_CAP_A.1 25.72,31.12 | BUCK_CAP_B.1 HB.3 | BUCK_CAP_C.1 v48.58,32.07
  Top 5.08: HA.3 29.53,31.08 | 29.53,31.08 HB.3 HC.3 | VCC.TP 25.72,31.12 29.49,31.12 29.53,31.08
  Bottom 0.152: 48.26,31.12 v47.63,31.12 v46.67,31.12
  Bottom 0.381: IC1.25 42.9,44.42 43.02,44.3 43.5,43.82 45.09,43.82 PVDD_BYPASS_CAP1.1
  Bottom 0.508: PVDD_BYPASS_CAP2.1 45.09,42.34 45.09,43.82 | PVDD_BYPASS_CAP1.1 43.55,43.82 42.95,44.42 42.95,44.37 43.02,44.3
  Bottom 1.524: PVDD_BYPASS_CAP2.1 45.19,34.19 48.26,31.12
  Bottom 4.318: VCC.TP PBCAP.+ PBCAP1.+
  other vias: 46.67,32.07
  pour Top (no thermals): 46.04,33.98 46.04,27.95 51.12,27.95 51.12,33.98
  pour Bottom (no thermals): 46.04,33.66 46.04,27.95 51.12,27.95 51.12,33.66
  pour Bottom (no thermals): 42.7,45.41 42.7,44.06 42.86,43.9 43.42,43.35 44.45,43.35 44.53,43.27 44.53,41.68 44.61,41.6 45.8,41.6 45.8,43.9 45.48,44.22 43.81,44.22 43.18,44.85 43.18,45.41
  pour Bottom (no thermals): 3.49,33.34 3.49,22.55 17.78,22.55 17.78,23.18 17.78,33.34

### Text on the board
tPlace: A | B | I | GND | GND | 3V3 | Rx | Tx | GND | 3V3